# EasyEDA Pro project homeKit_HumC.eprj

# Schematic Schematic1
Create Date: 2022-08-31; Page Name: P1; Project Name: homeKit_HumC; Schematic Name: Schematic1; Update Date: 2022-09-01; Company: 嘉立创EDA
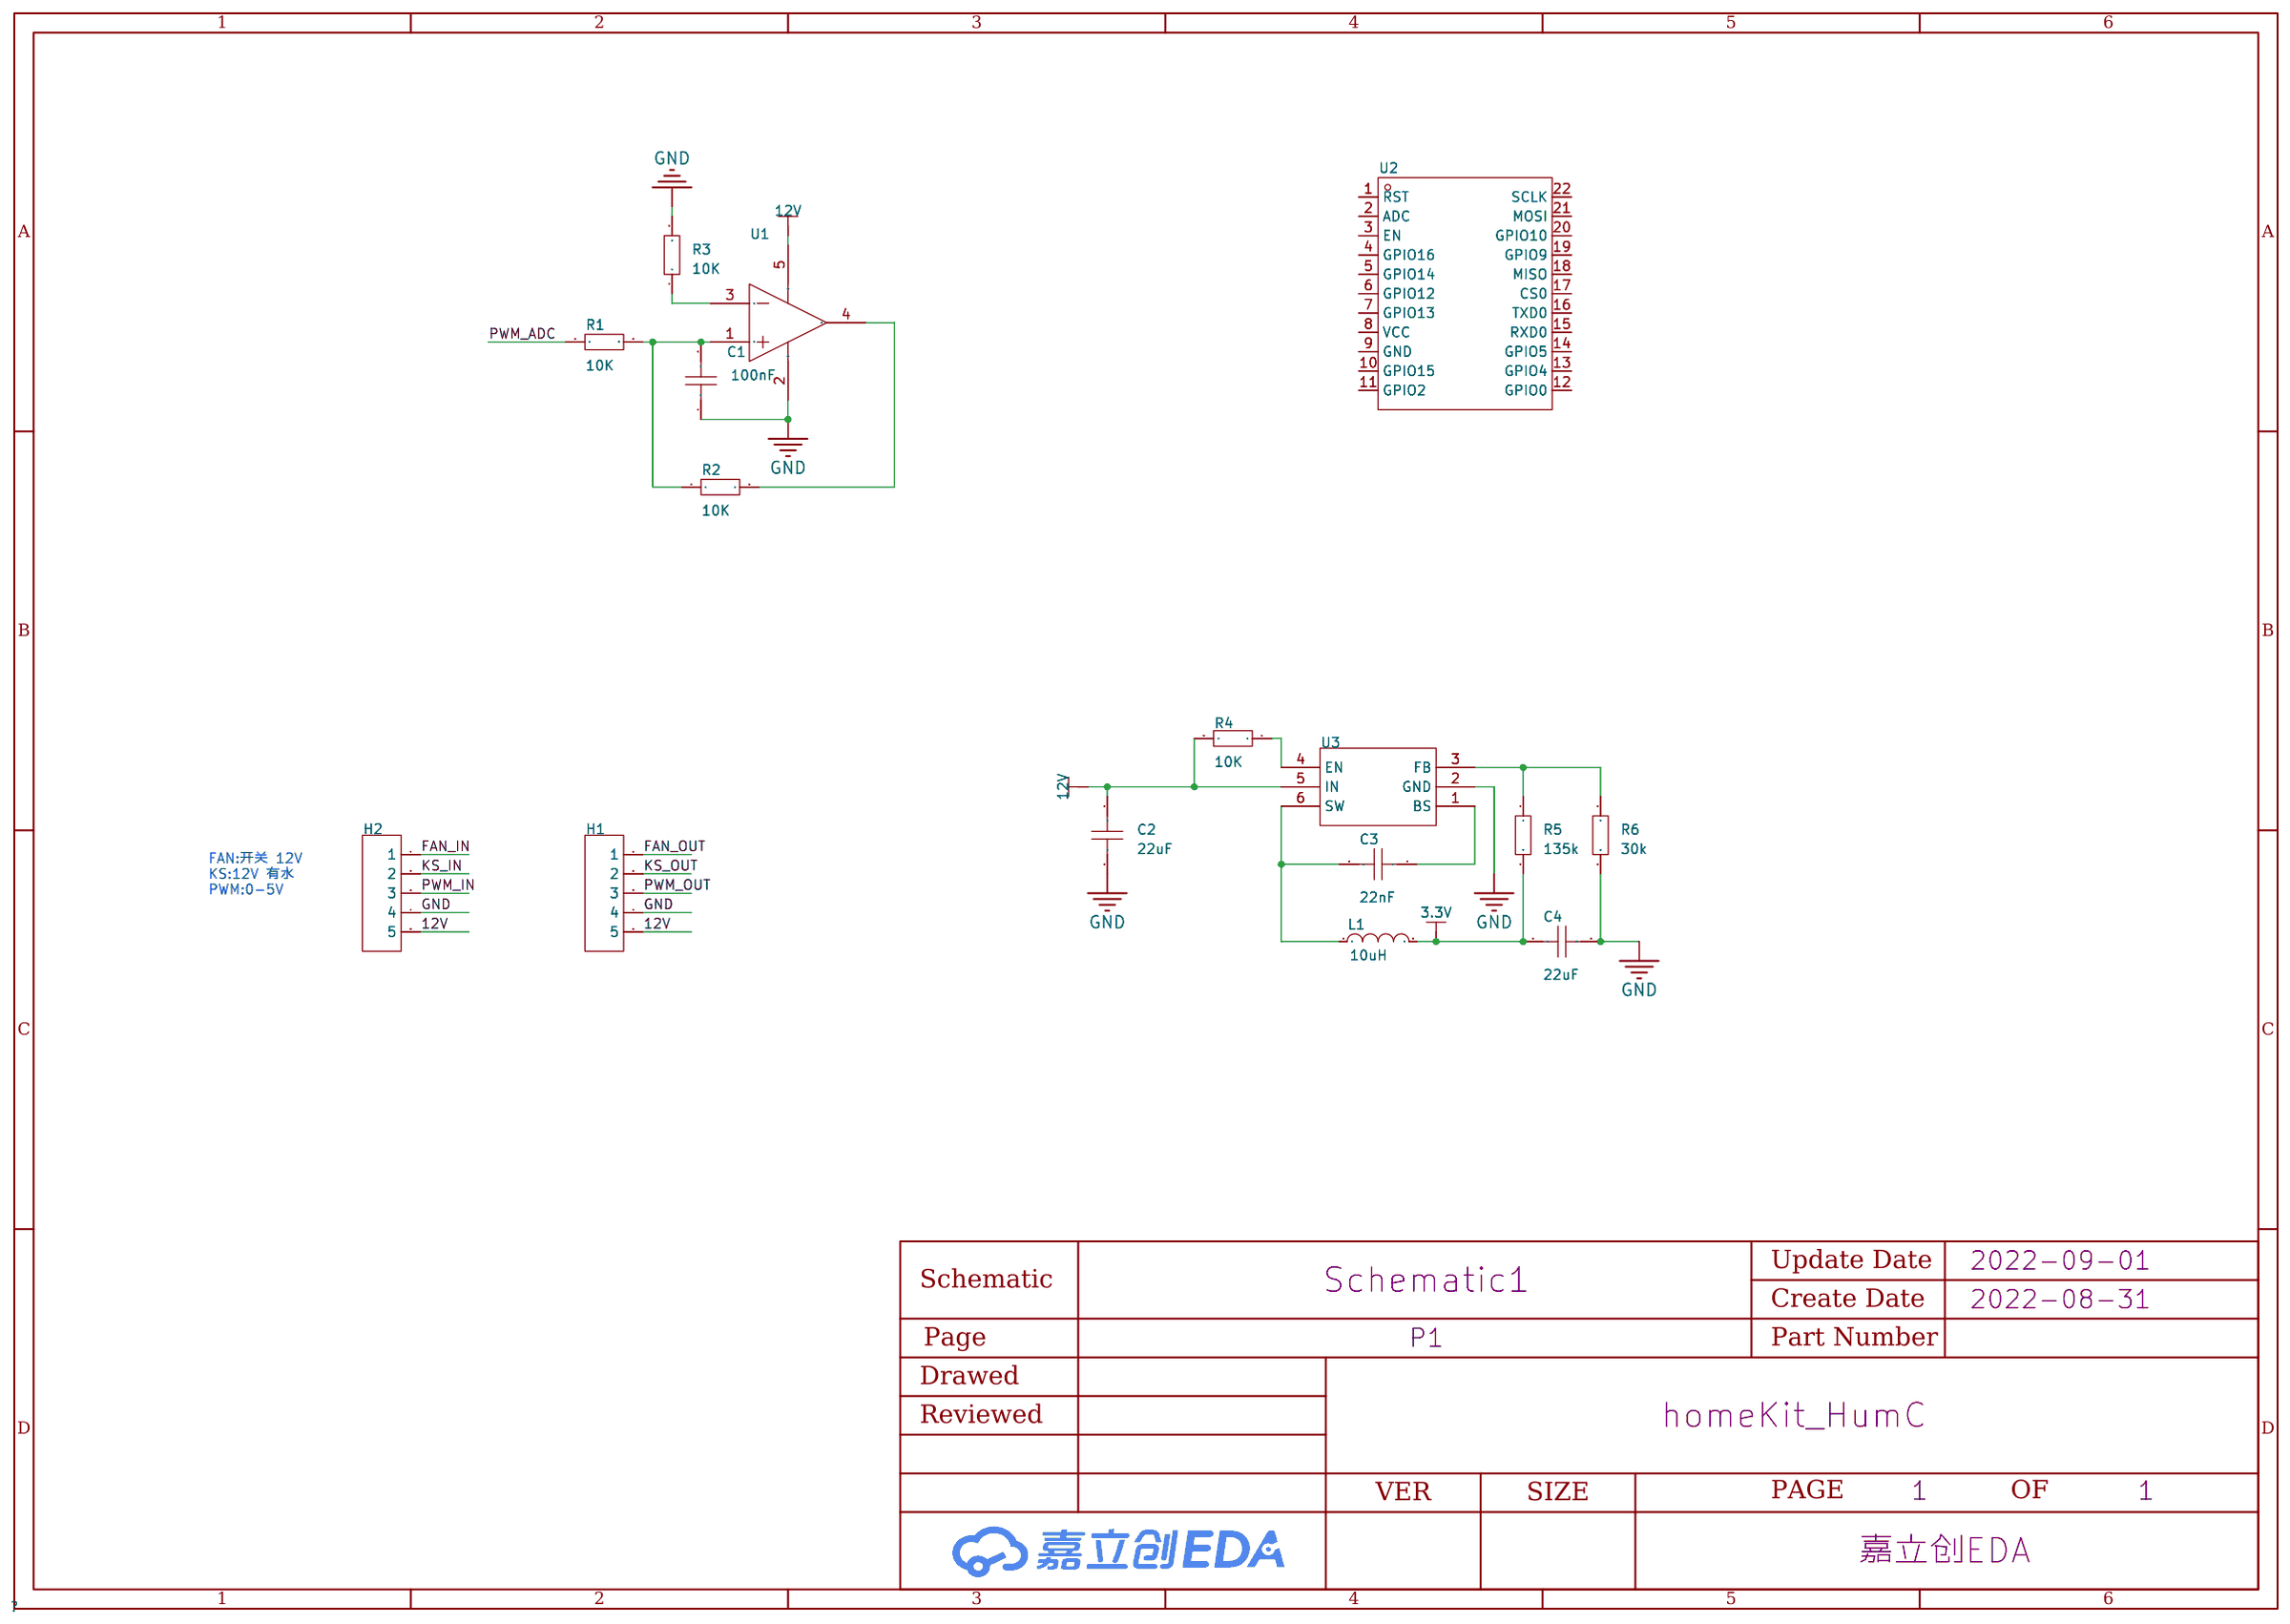
[diagram p0: schematic sheet]

## Parts
C1  100nF  [C0805]
C2  22uF  [C0805]
C3  22nF  [C0603]
C4  22uF  [C0805]
H1  -  [HDR-TH_5P-P2.54-V-F]
H2  -  [HDR-TH_5P-P2.54-V-F]
L1  10uH  [IND-SMD_L7.4-W6.6]
R1  10K  [R0603]
R2  10K  [R0603]
R3  10K  [R0603]
R4  10K  [R0603]
R5  135k  [R0603]
R6  30k  [R0603]
U1  LM321  [SOT-23-5_L2.9-W1.6-P0.95-LS2.8-BR]
U2  ESP-12F(ESP8266MOD)  [WIFIM-SMD_ESP-12F-ESP8266MOD]
U3  MT2492  [SOT-23-6_L2.9-W1.6-P0.95-LS2.8-BR]

## Library data of the parts
C1 C2 C4 = CAP_0805: 容值:100nF;精度:±10%;额定电压:50V;温度系数:X7R;; Supplier Footprint: 0805
C3 = CAP_0603: 容值:100nF;精度:±10%;额定电压:50V;温度系数:X7R;; Supplier Footprint: 0603
H1 H2 = HDR-F_2.54_1x5P: Supplier Part: C50950; Supplier Footprint: 插件
L1 = CKST0603-10uH/M: 电感值:10uH;精度:±20%;额定电流:4A;饱和电流(Isat):5A;直流电阻(DCR):68mΩ;; LCSC Part Name: 10uH ±20% 4A 68mΩ; Supplier Part: C3002639; Manufacturer: CENKER(岑科); Supplier Footprint: SMD,7.4x6.6x3mm; JLCPCB Part Class: 扩展库; Datasheet: https://atta.szlcsc.com/upload/public/pdf/source/20220510/B48FE89972EB9627500571FF6CB43AFA.pdf; Supplier: LCSC; Tolerance: ±20%; Rated Current: 4A; Saturation Current (Isat): 5A; DC Resistance (DCR): 68mΩ
R1-R6 = Res_0603: Supplier Footprint: 0603
U1 = LM321: Supplier Part: C2829424; Manufacturer: CJ(江苏长电/长晶); Supplier Footprint: SOT-23-5L; Datasheet: https://atta.szlcsc.comnull; Supplier: LCSC
U2 = ESP-12F(ESP8266MOD): 屏蔽罩上的丝印是：ESP8266MOD，ESP8266EX串口WIFI; Supplier Part: C82891; Manufacturer: Ai-Thinker(安信可); Supplier Footprint: WIFI模块; JLCPCB Part Class: 扩展库; Datasheet: https://atta.szlcsc.com/upload/public/pdf/source/20181205/C82891_2E0132AC394619135072CDB340405D53.pdf; Supplier: LCSC
U3 = MT2492: 功能类型:降压型;同步整流:-;输出通道数:-;拓扑结构:-;输入电压:-;输出电流(最大值):-;开关频率:-;; LCSC Part Name: 降压型; Supplier Part: C89358; Manufacturer: 西安航天民芯; Supplier Footprint: SOT-23-6; JLCPCB Part Class: 扩展库; Datasheet: https://atta.szlcsc.com/upload/public/pdf/source/20170628/1498635304645.pdf; Supplier: LCSC; Function: 降压型

## Nets
3.3V: C4.1 L1.2 R5.2
12V: C2.1 H1.5 H2.5 R4.2 U1.5(+VS) U3.5(IN)
GND: C1.1 C2.2 C4.2 H1.4 H2.4 R3.2 R6.2 U1.2(-VS) U3.2(GND)
FAN_IN: H2.1
FAN_OUT: H1.1
KS_IN: H2.2
KS_OUT: H1.2
PWM_ADC: R1.1
PWM_IN: H2.3
PWM_OUT: H1.3
Net-(C1-2): C1.2 R1.2 R2.1 U1.1(+IN)
Net-(C3-1): C3.1 U3.1(BS)
Net-(C3-2): C3.2 L1.1 U3.6(SW)
Net-(R2-2): R2.2 U1.4(OUT)
Net-(R3-1): R3.1 U1.3(-IN)
Net-(R4-1): R4.1 U3.4(EN)
Net-(R5-1): R5.1 R6.1 U3.3(FB)

Not connected (* = marked no-connect by the designer): U2 1(RST) 2(ADC) 3(EN) 4(GPIO16) 5(GPIO14) 6(GPIO12) 7(GPIO13) 8(VCC) 9(GND) 10(GPIO15) 11(GPIO2) 12(GPIO0) 13(GPIO4) 14(GPIO5) 15(RXD0) 16(TXD0) 17(CS0) 18(MISO) 19(GPIO9) 20(GPIO10) 21(MOSI) 22(SCLK)

## Notes on the sheet
- FAN:开关 12V
  KS:12V 有水
  PWM:0-5V
